# Altium schematic sheet bmsMaster_can.SchDoc
size B; SheetNumber: 8; SheetTotal: 9
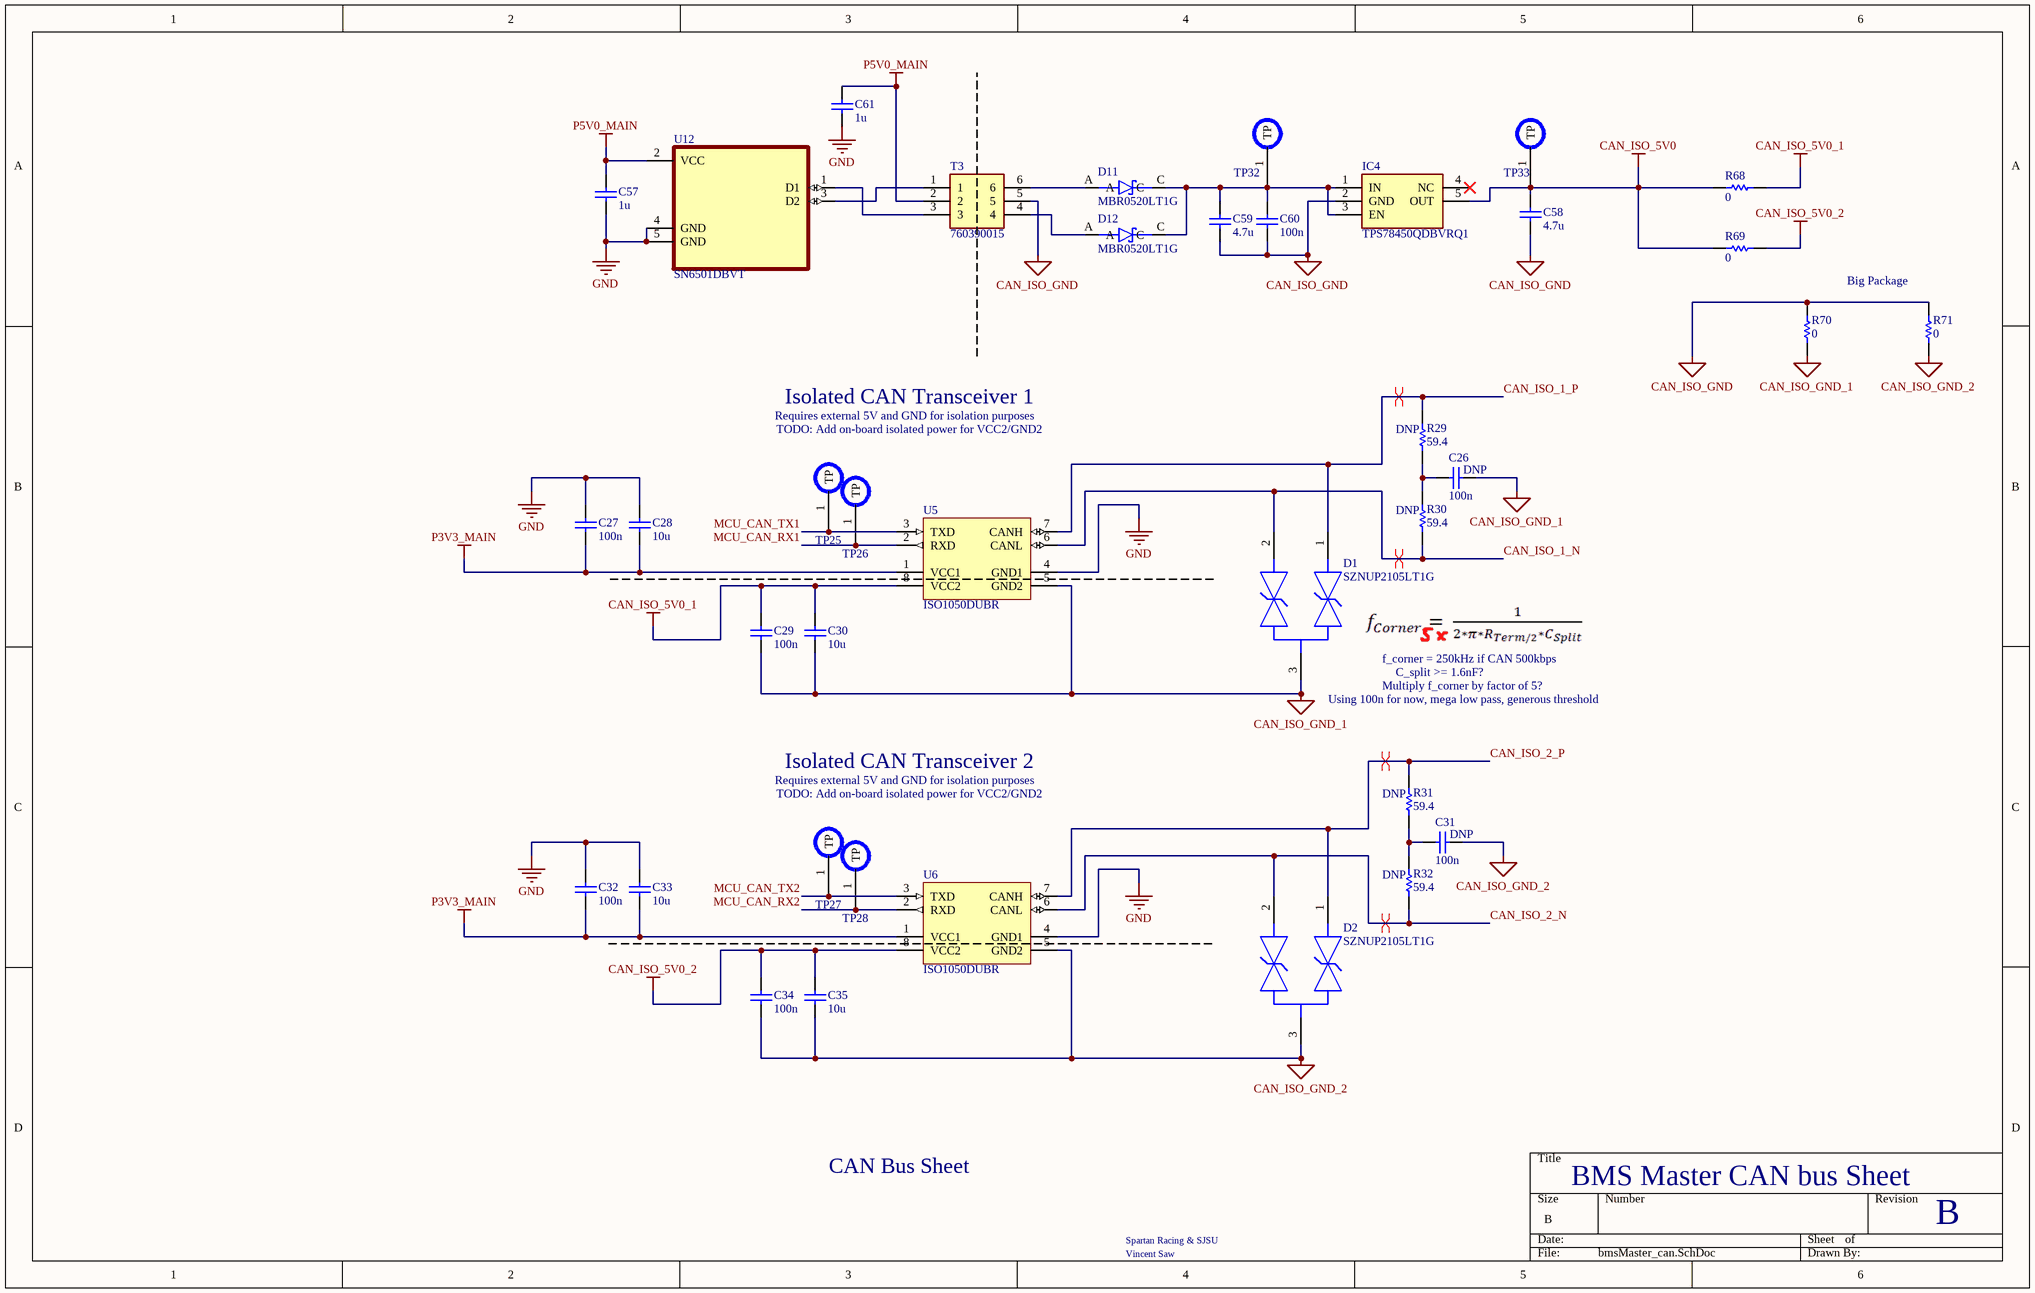
[diagram p0: bmsMaster_can.SchDoc]

## Parts
C26  value 100n  [CAPC1608X90N]  (hidden comment: Capacitor)
C27  value 100n  [CAPC1608X90N]  (hidden comment: Capacitor)
C28  value 10u  [CAPC1608X90N]  (hidden comment: Capacitor)
C29  value 100n  [CAPC1608X90N]  (hidden comment: Capacitor)
C30  value 10u  [CAPC1608X90N]  (hidden comment: Capacitor)
C31  value 100n  [CAPC1608X90N]  (hidden comment: Capacitor)
C32  value 100n  [CAPC1608X90N]  (hidden comment: Capacitor)
C33  value 10u  [CAPC1608X90N]  (hidden comment: Capacitor)
C34  value 100n  [CAPC1608X90N]  (hidden comment: Capacitor)
C35  value 10u  [CAPC1608X90N]  (hidden comment: Capacitor)
C57  value 1u  [CAPC1608X90N]  (hidden comment: Capacitor)
C58  value 4.7u  [CAPC1608X90N]  (hidden comment: Capacitor)
C59  value 4.7u  [CAPC1608X90N]  (hidden comment: Capacitor)
C60  value 100n  [CAPC1608X90N]  (hidden comment: Capacitor)
C61  value 1u  [CAPC1608X90N]  (hidden comment: Capacitor)
D1  SZNUP2105LT1G  [FP-318-08-MFG]
D2  SZNUP2105LT1G  [FP-318-08-MFG]
D11  MBR0520LT1G  [SOD3716X135N]
D12  MBR0520LT1G  [SOD3716X135N]
IC4  TPS78450QDBVRQ1  [SOT95P280X145-5N]
R29  value 59.4  [RESC1608X50N]  (hidden comment: Resistor)
R30  value 59.4  [RESC1608X50N]  (hidden comment: Resistor)
R31  value 59.4  [RESC1608X50N]  (hidden comment: Resistor)
R32  value 59.4  [RESC1608X50N]  (hidden comment: Resistor)
R68  value 0  [RESC1608X50N]  (hidden comment: Resistor)
R69  value 0  [RESC1608X50N]  (hidden comment: Resistor)
R70  value 0  [RESC1608X50N]  (hidden comment: Resistor)
R71  value 0  [RESC1608X50N]  (hidden comment: Resistor)
T3  760390015  [760390015]
TP25  TSTPT  [Testpoint1]  (value not drawn)  (no BOM)
TP26  TSTPT  [Testpoint1]  (value not drawn)  (no BOM)
TP27  TSTPT  [Testpoint1]  (value not drawn)  (no BOM)
TP28  TSTPT  [Testpoint1]  (value not drawn)  (no BOM)
TP32  TSTPT  [Testpoint1]  (value not drawn)  (no BOM)
TP33  TSTPT  [Testpoint1]  (value not drawn)  (no BOM)
U5  ISO1050DUBR  [DUB0008A_L]
U6  ISO1050DUBR  [DUB0008A_L]
U12  SN6501DBVT  [SOT95P280X145-5N]

## Nets
CAN_ISO_5V0: C58.2 IC4.5(OUT) R68.1 R69.1 TP33.1(TP)
CAN_ISO_5V0_1: C29.2 C30.2 R68.2 U5.8(VCC2)
CAN_ISO_5V0_2: C34.2 C35.2 R69.2 U6.8(VCC2)
CAN_ISO_GND: C58.1 C59.1 C60.1 IC4.2(GND) R70.2 R71.2 T3.5
CAN_ISO_GND_1: C26.1 C29.1 C30.1 D1.3 R70.1 U5.5(GND2)
CAN_ISO_GND_2: C31.1 C34.1 C35.1 D2.3 R71.1 U6.5(GND2)
GND: C27.2 C28.2 C32.2 C33.2 C57.1 C61.1 U5.4(GND1) U6.4(GND1) U12.4(GND) U12.5(GND)
P3V3_MAIN: C27.1 C28.1 C32.1 C33.1 U5.1(VCC1) U6.1(VCC1)
P5V0_MAIN: C57.2 C61.2 T3.2 U12.2(VCC)
CAN_ISO_1_N: D1.2 R30.1 U5.6(CANL)
CAN_ISO_1_P: D1.1 R29.2 U5.7(CANH)
CAN_ISO_2_N: D2.2 R32.1 U6.6(CANL)
CAN_ISO_2_P: D2.1 R31.2 U6.7(CANH)
MCU_CAN_RX1: TP26.1(TP) U5.2(RXD)
MCU_CAN_RX2: TP28.1(TP) U6.2(RXD)
MCU_CAN_TX1: TP25.1(TP) U5.3(TXD)
MCU_CAN_TX2: TP27.1(TP) U6.3(TXD)
NetC26_2: C26.2 R29.1 R30.2
NetC31_2: C31.2 R31.1 R32.2
NetC59_2: C59.2 C60.2 D11.C D12.C IC4.1(IN) IC4.3(EN) TP32.1(TP)
NetD11_A: D11.A T3.6
NetD12_A: D12.A T3.4
NetT3_1: T3.1 U12.3(D2)
NetT3_3: T3.3 U12.1(D1)

Not connected (* = marked no-connect by the designer): IC4 4(NC)*

## Layout directives
differential pair: CAN_ISO_1_N, CAN_ISO_1_P, CAN_ISO_2_N, CAN_ISO_2_P

## Notes on the sheet
- Big Package
- Requires external 5V and GND for isolation purposes
- Isolated CAN Transceiver 1
- TODO: Add on-board isolated power for VCC2/GND2
- (near R29) DNP
- (near C26) DNP
- (near R30) DNP
- (near D1) Using 100n for now, mega low pass, generous threshold
- f_corner = 250kHz if CAN 500kbps
- Multiply f_corner by factor of 5?
- C_split >= 1.6nF?
- Isolated CAN Transceiver 2
- (near R31) DNP
- (near C31) DNP
- (near R32) DNP
- CAN Bus Sheet
- Spartan Racing & SJSU
- BMS Master CAN bus Sheet
- B
- Vincent Saw

## Library data of the parts
C26-C35 C57-C61 = Capacitor: SimulationGenericComponent: True
D1 D2 = CMP-1063-00167-2: TVS DIODE 24V 44V SOT23-3; Manufacturer: ON Semiconductor; Capacitance: 30pF; Max Junction Temp: +150°C; Breakdown Voltage: 26.2V; Number Of Channels: 2; Automotive Grade: Grade 0; Standoff Height: 0.01mm; Peak Pulse Current: 8A; Value: 30pF; Direction: Bidirectional; Peak Pulse Power: 350W; Octopart: https://octopart.com/sznup2105lt1g-on+semiconductor-22134626; Reverse Standoff Voltage: 24V; Digikey Description: TVS DIODE 24V 44V SOT23-3; RoHS: TRUE; Manufacturer Part Number: SZNUP2105LT1G; Height: 1.11mm; Automotive: Yes; ComponentLink2URL: https://www.onsemi.com/pub/Collateral/NUP2105L-D.PDF; Device Class L3: unset; Package: 318-08; Lead Free: Yes; Device Class L2: TVS Diodes; Footprint Url: https://www.onsemi.com/pub/Collateral/318-08.PDF; Temperature Range Low: -55°C; Device Class L1: Circuit Protection; Temperature: -55°C to +150°C; Temperature Range High: +150°C; Category: Diode; Clamping Voltage: 44V; ComponentLink2Description: Datasheet
D11 D12 = MBR0520LT1G: Rectifier, Schottky Power; Plastic Sod-123; 0.5 a @ +90c If; +125; 20v; 1000; MF: {'manufacturer': u'ON Semiconductor'}; Package: None; Price: None; Value: *; MP: MBR0520LT1G; Availability: Unavailable
IC4 = TPS78450QDBVRQ1: Integrated Circuit; Manufacturer_Name: Texas Instruments; Datasheet Link: https://www.ti.com/lit/ds/symlink/tps784-q1.pdf?ts=1621597556803&ref_url=https%253A%252F%252Fwww.ti.com%252Fstore%252Fti%252Fen%252Fp%252Fproduct%252F%253Fp%253DTPS78401QDBVRQ1; Height: 1.45mm; Manufacturer_Part_Number: TPS78450QDBVRQ1; Mouser Part Number: 595-TPS78450QDBVRQ1; Mouser Price/Stock: https://www.mouser.co.uk/ProductDetail/Texas-Instruments/TPS78450QDBVRQ1?qs=OlC7AqGiEDlNiKKFTXJdtA%3D%3D
R29-R32 = Resistor: TC1: 0; SimulationGenericComponent: True; TC2: 0
R68-R71 = Resistor: SimulationGenericComponent: True; TC1: 0; TC2: 0
T3 = 760390015: Transformer; Manufacturer_Name: Wurth Elektronik; Datasheet Link: https://www.we-online.com/components/products/datasheet/760390015.pdf; Manufacturer_Part_Number: 760390015; Mouser Part Number: 710-760390015; Mouser Price/Stock: https://www.mouser.co.uk/ProductDetail/Wurth-Elektronik/760390015?qs=wElim4iM2pjOQCmk%252B8YbFA%3D%3D
TP25-TP28 TP32 TP33 = Testpoint1
U5 U6 = CMP-0315-00093-2: Isolated CAN Transceiver, -55 to 105 degC, 8-pin SOP (DUB), Green (RoHS & no Sb/Br); Manufacturer: Texas Instruments; Rating: Catalog; Isolated: Yes; Drivers Per Package: 1; PackageReference: DUB0008A; PartNumber: ISO1050DUBR; ComponentLink2Description: Package Specification; ComponentLink1Description: Datasheet; Mounting Technology: Surface Mount; ComponentLink1URL: http://www.ti.com/general/docs/lit/getliterature.tsp?genericPartNumber=ISO1050&fileType=pdf; ComponentLink2URL: http://www.ti.com/litv/pdf/mpds247b; Eco-Plan: Green (RoHS & no Sb/Br); PackageDescription: 8-Pin Small Outline Package 2.54 mm Pitch; PackageVersion: revC, May-2006; SubFamily: CAN; DatasheetVersion: SLLS983E
U12 = SN6501DBVT: MF: {'manufacturer': u'Texas Instruments'}; Package: None; Price: None; Value: *; MP: SN6501DBVT; Availability: Unavailable